# EAGLE design kicker (EAGLE 7.4.0)
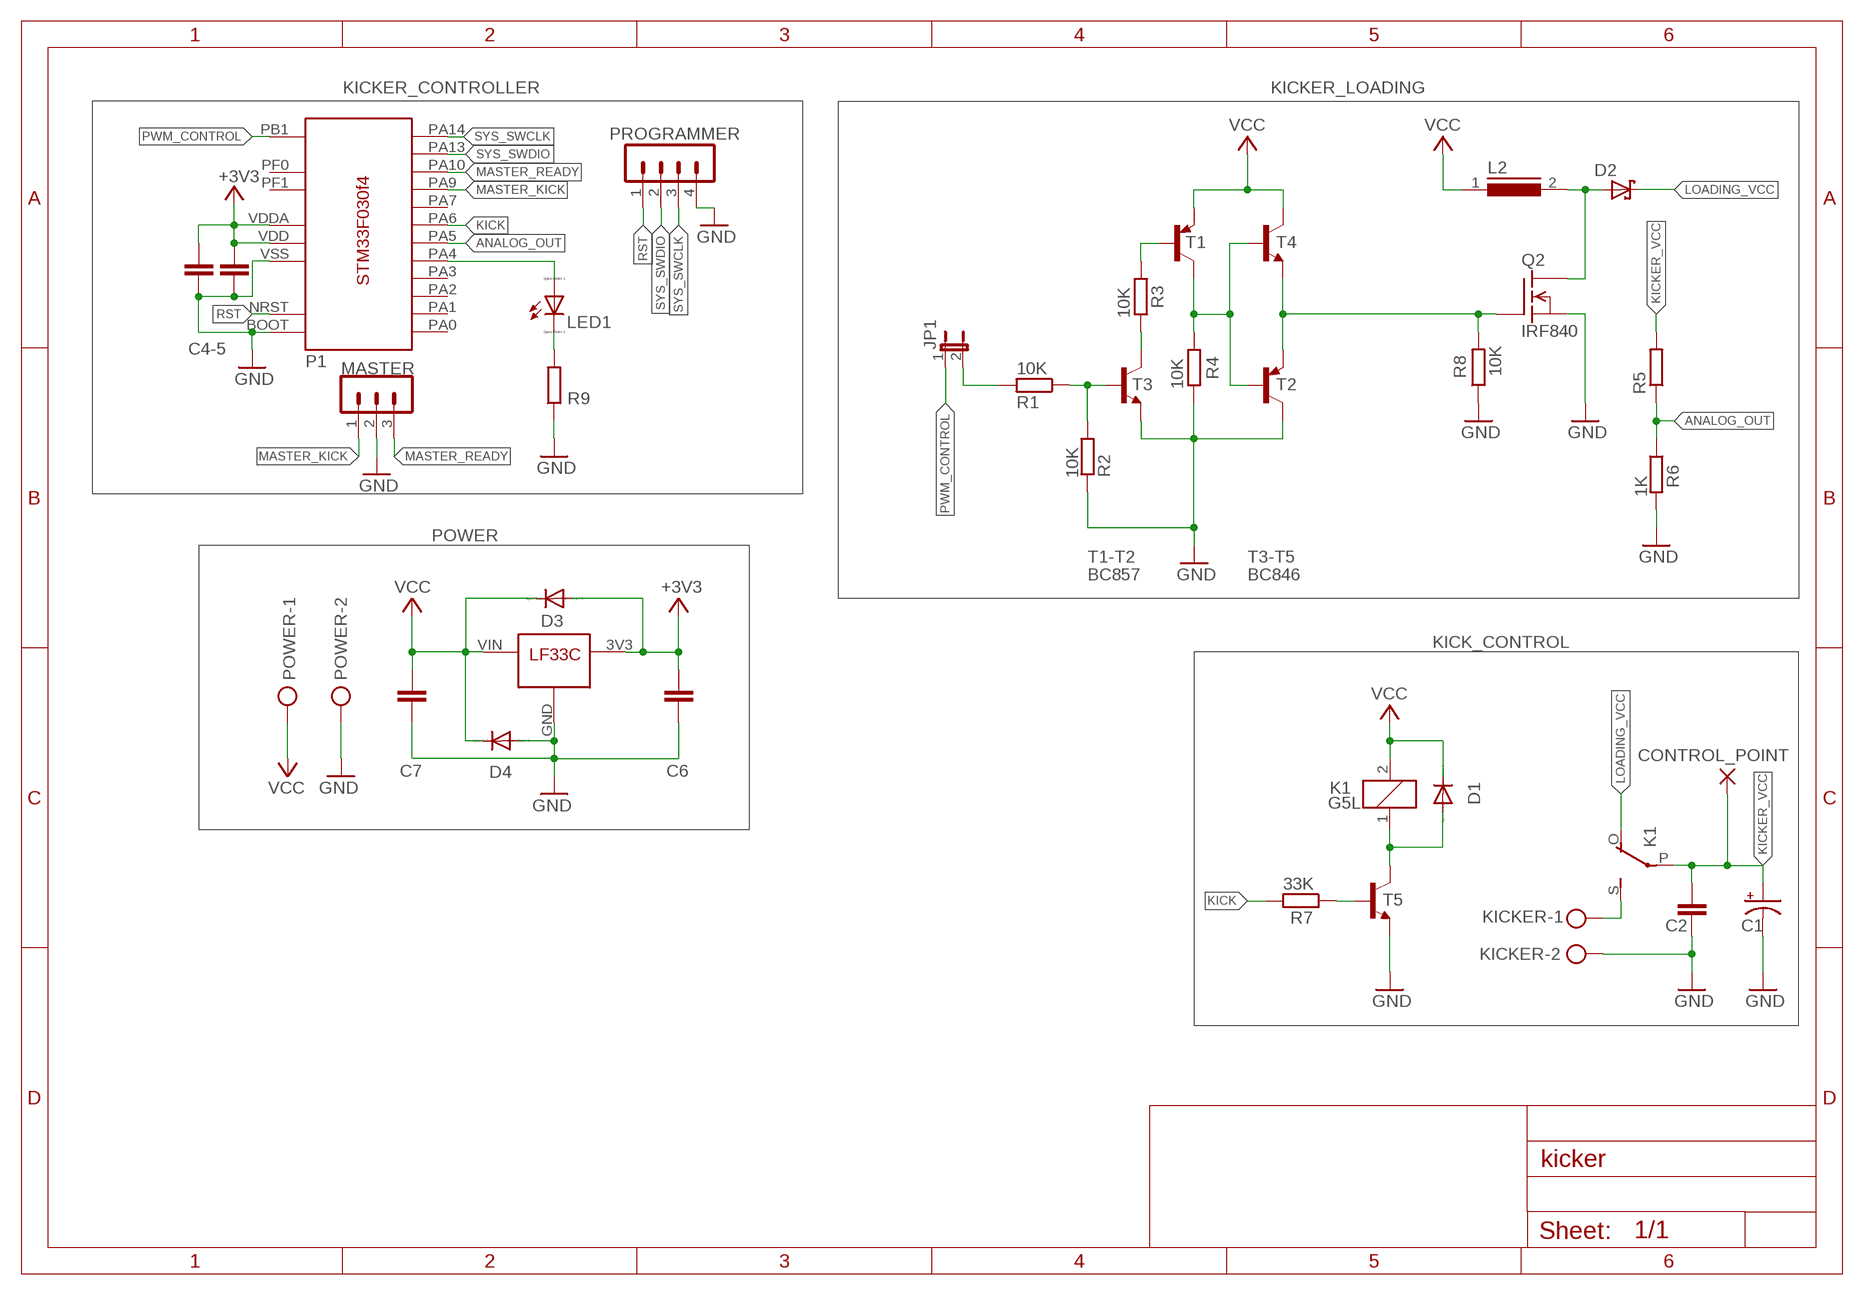
[diagram p0: schematic, sheet 1]

## Parts
C1  CPOL-USE10-30  [EB30D]
C2  C-EU275-113X316  [C275-113X316]
C4  100K  C-EUC0603  [C0603]
C5  100K  C-EUC0603  [C0603]
C6  100k  C-EUC0603  [C0603]
C7  100k  C-EUC0603  [C0603]
CONTROL_POINT  3,81/1,4  [3,81/1,4]
D1  DIODE-MINIMELF  [MINIMELF]
D2  1N6267A  [C4111-15]
D3  DIODE-MINIMELF  [MINIMELF]
D4  DIODE-MINIMELF  [MINIMELF]
JP1  JP1E  [JP1]
K1  G5L  [G5LE]
KICKER  W237-102  [W237-102]
L2  SFT830S  [SFT830S]
LED1  LED_E  [LED_1206]
MASTER  MA03-1  [MA03-1]
P1  STM32F030F4  [STM32F030F4]
POWER  W237-102  [W237-102]
PROGRAMMER  MA04-1  [MA04-1]
Q2  IRF840  [TO220]
R1  10K  R-EU_R0603  [R0603]
R2  10K  R-EU_R0603  [R0603]
R3  10K  R-EU_R0603  [R0603]
R4  10K  R-EU_R0603  [R0603]
R5  R-EU_0309/10  [0309/10]
R6  1K  R-EU_R0603  [R0603]
R7  33K  R-EU_R0603  [R0603]
R8  10K  R-EU_R0603  [R0603]
R9  R-EU_R0603  [R0603]
T1  BC856A-PNP-SOT23-BEC  [SOT23-BEC]
T2  BC856A-PNP-SOT23-BEC  [SOT23-BEC]
T3  BC847  [SOT23]
T4  BC847  [SOT23]
T5  BC847  [SOT23]
U$1  LF33C  [LF33C]

## Nets
+3V3: C4.1 C5.1 C6.1 D3.A P1.VDD P1.VDDA U$1.3V3
ANALOG_OUT: P1.PA5 R5.1 R6.1
GND: C1.- C2.2 C4.2 C5.2 C6.2 C7.2 D4.A KICKER.2 MASTER.2 P1.BOOT P1.VSS POWER.2 PROGRAMMER.4 Q2.3(S) R2.2 R4.2 R6.2 R8.1 R9.1 T2.C T3.2(E) T5.2(E) U$1.GND
KICK: P1.PA6 R7.2
KICKER_VCC: C1.+ C2.1 CONTROL_POINT.1(P) K1.P(2:P) R5.2
LOADING_VCC: D2.C K1.O(2:O)
MASTER_KICK: MASTER.1 P1.PA9
MASTER_READY: MASTER.3 P1.PA10
N$1: R7.1 T5.1(B)
N$2: JP1.2 R1.2
N$3: K1.S(2:S) KICKER.1
N$4: D1.A K1.1 T5.3(C)
N$5: R1.1 R2.1 T3.1(B)
N$9: LED1.C R9.2
N$10: LED1.A P1.PA4
N$11: R3.1 T1.B
N$13: R3.2 T3.3(C)
N$15: R4.1 T1.C T2.B T4.1(B)
N$16: Q2.1(G) R8.2 T2.E T4.2(E)
N$17: D2.A L2.2 Q2.2(D)
PWM_CONTROL: JP1.1 P1.PB1
RST: P1.NRST PROGRAMMER.1
SYS_SWCLK: P1.PA14 PROGRAMMER.3
SYS_SWDIO: P1.PA13 PROGRAMMER.2
VCC: C7.1 D1.C D3.C D4.C K1.2 L2.1 POWER.1 T1.E T4.3(C) U$1.VIN
Unconnected: P1.PA0 P1.PA1 P1.PA2 P1.PA3 P1.PA7 P1.PF0 P1.PF1

## Notes on the sheet
- KICKER_CONTROLLER | KICKER_LOADING
- C4-5
- POWER
- T1-T2 | T3-T5
- BC857 | BC846
- KICK_CONTROL

## Library data of the parts
C1 = rcl:CPOL-US: POLARIZED CAPACITOR, American symbol
C2 C4-C7 = rcl:C-EU: CAPACITOR, European symbol
CONTROL_POINT = wirepad:3,81/1,4: THROUGH-HOLE PAD
D1 D3 D4 = diode:DIODE-: DIODE
D2 = diode:1N6267A: DIODE transient voltage suppressor
JP1 = jumper:JP1E: JUMPER
K1 = relay:G5L: RELAY 1 x switch, 10 A/120 V AC, 8 A/30 V ADC, Omron; OC_FARNELL: unknown; OC_NEWARK: unknown
KICKER POWER = con-wago-500:W237-102: WAGO SCREW CLAMP; MPN: 237-102; OC_FARNELL: unknown; OC_NEWARK: 70K9898
L2 = inductors:SFT830S: INDUCTOR
LED1 = eagle-ltspice:LED_E: LED Source: http://www.osram.convergy.de Source: www.luxeon.com Source: www.kingbright.com; SPICEMODEL: NONE; SPICEPREFIX: D; SPICETYPE: diode
MASTER = con-lstb:MA03-1: PIN HEADER; OC_FARNELL: unknown; OC_NEWARK: unknown
P1 = stm32f030f4:STM32F030F4
PROGRAMMER = con-lstb:MA04-1: PIN HEADER; OC_FARNELL: unknown; OC_NEWARK: unknown
Q2 = transistor-fet:IRF840: N-Channel Enhancement MOSFET (HEXFET); 500V; 8A; 0,85Ohm
R1-R9 = rcl:R-EU_: RESISTOR, European symbol
T1 T2 = transistor-neu-to92:*-PNP-: PNP Transistror
T3-T5 = transistor-neu-to92:BC847: NPN TRANSISTOR
U$1 = regulator:LF33C

## Board
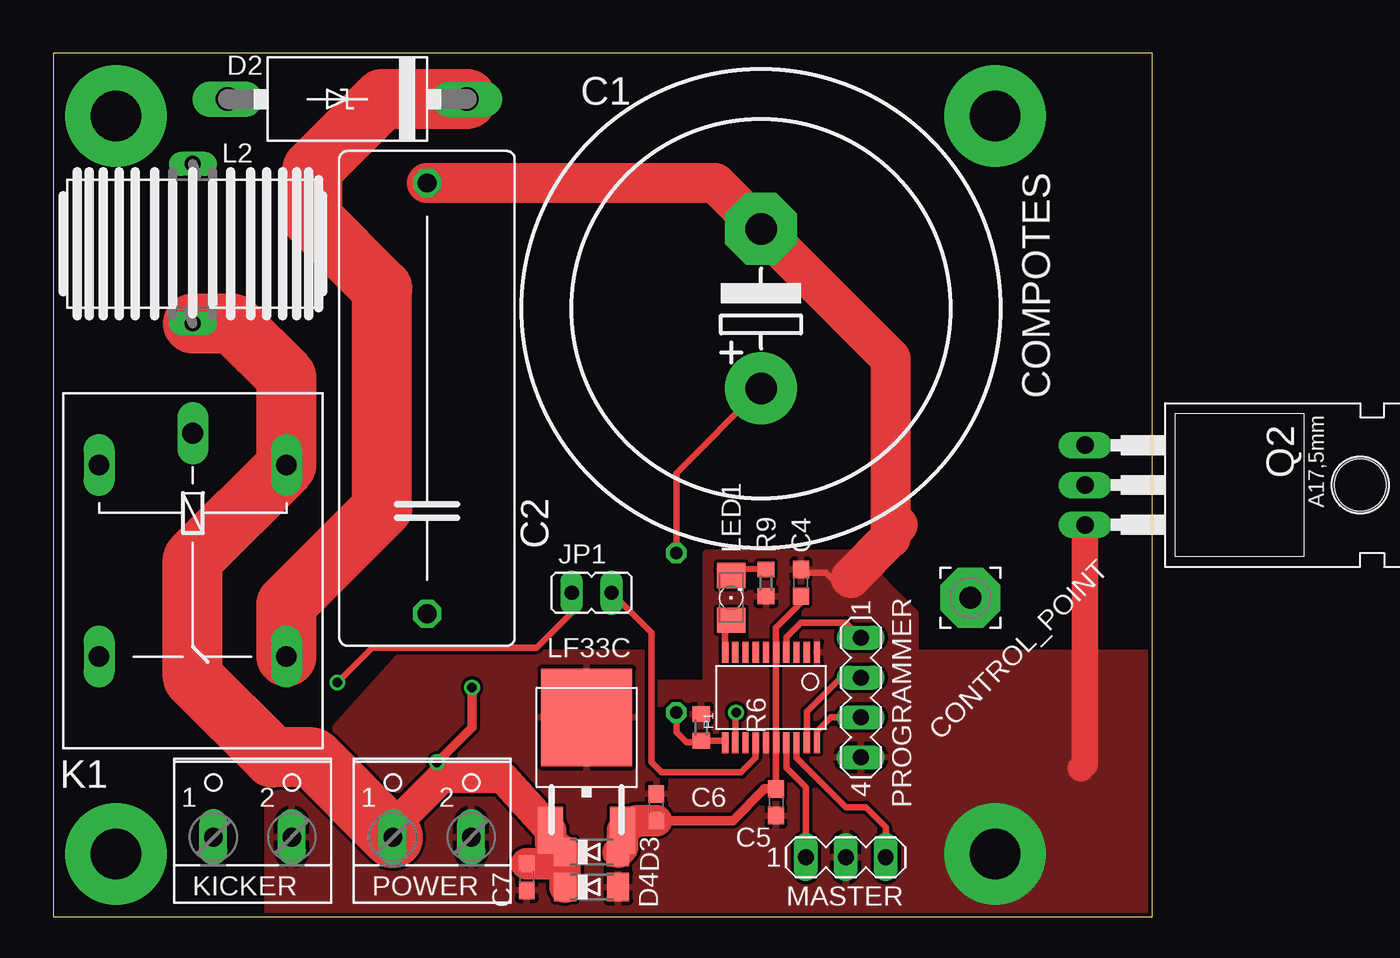
[diagram p1: board, top side]
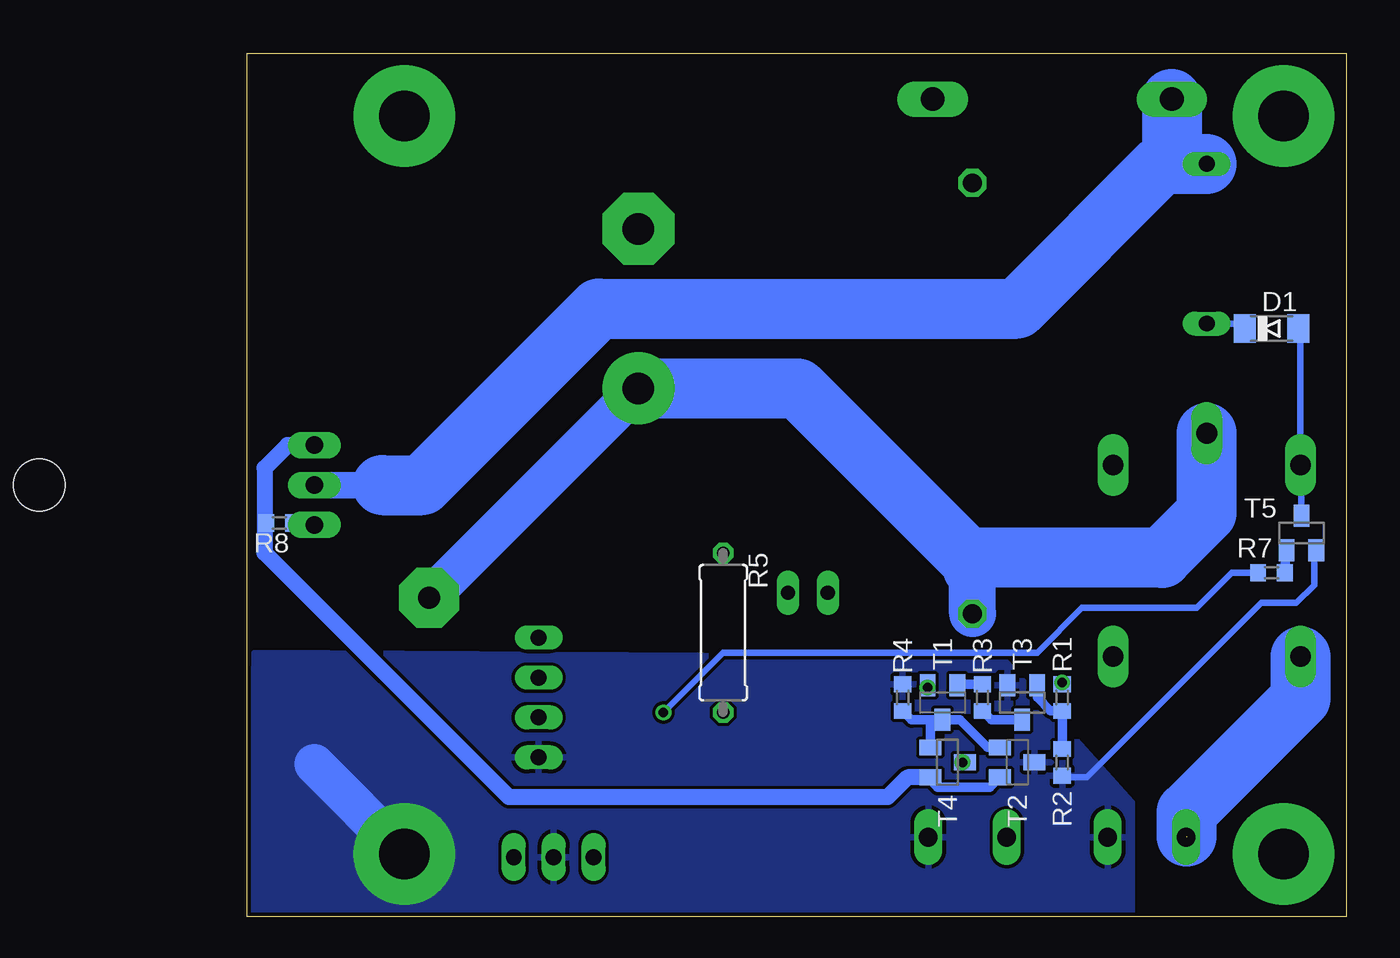
[diagram p2: board, bottom side, seen from below]

Size 70 x 55 mm. Coordinates in mm from the lower left corner, seen from the top.
Outline: 0,0 70,0 70,55 0,55 0,0
Copper layers (1*16): Top 0.035mm / dielectric 1.5mm / Bottom 0.035mm
Design rules "default *": minimum track width 10mil, minimum drill 24mil, track to track 8mil, track to pad 8mil, pad to pad 8mil, via to via 8mil, smd to smd 8mil, copper to edge 10mil, drill to drill 8mil, minimum pad ring 10mil, minimum via ring 8mil, stop-mask expansion 4mil, vias tented up to drill 0mil, thermal gap 10mil

### Footprints (pad centres in the part's own frame; a part is rotated, then mirrored left to right if it is on the bottom)
EB30D = drill 2.007 pad 4.597: + -5.08,0 | drill 2.007 pad 4.597 octagon: - 5.08,0
C275-113X316 = drill 1.194 octagon: 1 -13.716,0; 2 13.716,0
C0603 = smd 1.1 x 1: 1 -0.85,0; 2 0.85,0
3,81/1,4 = drill 1.397 pad 3.81 octagon: 1 0,0
MINIMELF = smd 1.4 x 1.8: A 1.7,0; C -1.7,0
C4111-15 = drill 1.499 long: A 7.62,0; C -7.62,0
JP1 = drill 0.914 long: 1 0,-1.27; 2 0,1.27
G5LE = drill 1.321 long: 1 -7.493,-5.969; 2 -7.493,5.969; O 4.699,5.969; P -9.525,0; S 4.699,-5.969
W237-102 = drill 1.194 long: 1 -2.5,-1.27; 2 2.5,-1.27
SFT830S = drill 1.016 long: 1 -5.08,0; 2 5.08,0
LED_1206 = smd 1.6 x 1.803: A -1.422,0; C 1.422,0
MA03-1 = drill 1.016 long: 1 -2.54,0; 2 0,0; 3 2.54,0
STM32F030F4 = smd 1.35 x 0.4: BOOT -2.875,2.925; NRST -2.875,0.975; PA0 -2.875,-0.325; PA1 -2.875,-0.975; PA2 -2.875,-1.625; PA3 -2.875,-2.275; PA4 -2.875,-2.925; PA5 2.875,-2.925; PA6 2.875,-2.275; PA7 2.875,-1.625; PA9 2.875,0.975; PA10 2.875,1.625; PA13 2.875,2.275; PA14 2.875,2.925; PB1 2.875,-0.975; PF0 -2.875,2.275; PF1 -2.875,1.625; VDD 2.875,0.325; VDDA -2.875,0.325; VSS 2.875,-0.325
MA04-1 = drill 1.016 long: 1 -3.81,0; 2 -1.27,0; 3 1.27,0; 4 3.81,0
TO220 = drill 1.118 long: 1 -2.54,-6.35; 2 0,-6.35; 3 2.54,-6.35 | hole 3.302: 0,11.176
R0603 = smd 1 x 1.1: 1 -0.85,0; 2 0.85,0
0309/10 = drill 0.813 octagon: 1 -5.08,0; 2 5.08,0
SOT23-BEC = smd 1 x 1.4: B -0.95,-1.1; C 0,1.1; E 0.95,-1.1
SOT23 = smd 1 x 1.4: 1 -0.95,-1.1; 2 0.95,-1.1; 3 0,1.1
LF33C = smd 1.6 x 3: 3V3 2.285,-7.18; VIN -2.285,-7.18 | smd 5.8 x 6.2: GND 0,0

### Placement (x,y rotation side)
C1  45.09,38.73 90 top
C2  23.81,33.02 90 top
C4  47.62,21.27 90 top
C5  46.04,7.3 270 top
C6  38.42,6.99 90 top
C7  30.16,2.54 270 top
CONTROL_POINT  58.42,20.32 0 top
D1  4.76,37.47 0 bottom
D2  18.73,52.07 180 top
D3  34.29,4.13 0 top
D4  34.29,1.91 0 top
JP1  34.29,20.64 90 top
K1  8.89,21.27 270 top
KICKER  12.7,6.35 0 top
L2  8.89,42.86 90 top
LED1  43.18,20.32 90 top
MASTER  50.48,3.81 0 top
P1  45.72,13.97 270 top
POWER  24.13,6.35 0 top
PROGRAMMER  51.44,13.97 270 top
Q2  72.07,27.5 270 top
R1  18.1,13.97 90 bottom
R2  18.1,9.84 270 bottom
R3  23.18,13.97 270 bottom
R4  28.26,13.97 90 bottom
R5  39.69,18.1 90 bottom
R6  41.27,12.06 90 top
R7  4.76,21.91 180 bottom
R8  67.94,25.08 180 bottom
R9  45.4,21.27 90 top
T1  25.72,13.65 180 bottom
T2  20.95,9.84 270 bottom
T3  20.64,13.65 180 bottom
T4  25.4,9.84 270 bottom
T5  2.86,24.45 0 bottom
U$1  33.97,12.7 0 top

### Tracks (layer width: path | path; a pad name or v marks a point on that pad's centre or on a via)
2  (via drill 3.2 pad 6.45)
  other vias: 60,51
+3V3
  Top 0.406: C5.1 46.05,8.48 P1.VDD 46.04,11.1 46.04,16.84 P1.VDDA 46.05,18.42 47.62,20 C4.1
  Top 0.61: C6.1 43.28,6.13 45.3,8.15 C5.1
  Top 2: D3.A 36.26,4.39 U$1.3V3 37.19,6.13 C6.1
ANALOG_OUT
  Top 0.406: P1.PA5 42.67,11.21 R6.1 41.17,11.11 40.32,11.11 39.69,11.75 R5.1
GND  (via drill 3.2 pad 6.45)
  Top 0.406: 50.8,21.59 49.53,21.59 49.21,21.91 47.73,21.91 C4.2
  Top 1.676: Q2.3 65.72,9.72 65.47,9.46
  Top 2.54: 53.34,25.4 53.34,35.56 C1.- 42.16,46.74 C2.2 | 53.34,25.4 53.34,24.13 50.8,21.59 | 53.78,24.96 53.34,25.4
  Bottom 0.406: T5.2 2.05,23.35 2.05,21.12 3.17,20 5.4,20 16.51,8.89 18,8.89 R2.2 | R8.1 65.84,25.08 Q2.3
  Bottom 2.54: 65.72,9.72 v60,4
  pour Top: 72.39,-2.54 13.65,-2.54 13.65,7.3 22.23,16.83 38.1,16.83 38.1,14.92 41.59,14.92 41.59,23.18 51.12,23.18 54.93,19.37 54.93,16.83 72.39,16.83
  pour Bottom: 69.85,0 13.65,0 13.65,7.3 21.91,16.51 69.53,16.83
KICK  (via drill 0.6)
  Top 0.406: P1.PA6 43.45,13.07 v43.5,13.02
  Bottom 0.406: v43.5,13.02 39.69,16.83 19.68,16.83 16.83,19.68 9.53,19.68 7.3,21.91 R7.2
KICKER_VCC
  Top 0.406: C1.+ 39.69,28.26 R5.2
  Bottom 2.54: C1.+ CONTROL_POINT.1
  Bottom 3: C2.1 23.81,22.23
  Bottom 3.81: K1.P 8.89,25.72 11.75,22.86 23.81,22.86 | 23.81,22.86 24.13,22.86 34.92,33.66 C1.+ | 23.81,22.23 23.81,22.86
LOADING_VCC
  Top 3.81: K1.O 14.86,19.94 20.95,26.04 20.95,40.01 16.51,44.45 16.51,47.62 20.95,52.07 D2.C
MASTER_KICK
  Top 0.406: P1.PA9 46.7,9.5 47.94,8.26 MASTER.1
MASTER_READY
  Top 0.406: P1.PA10 47.34,10.12 50.48,6.99 51.75,6.99 53.02,5.71 MASTER.3
N$1
  Bottom 0.61: T5.1 3.88,23.28 3.88,22.07 R7.1
N$2  (via drill 0.6)
  Top 0.406: v18.1,14.92 20.32,17.14 30.8,17.14 33.02,19.37 JP1.2
  Bottom 0.406: R1.2 v18.1,14.92
N$3  (1 unrouted)
  Bottom 3.81: 10.16,5.12 10.16,6.67 2.92,13.91 K1.S
N$4
  Bottom 0.406: T5.3 2.86,28.7 K1.1 2.92,37.32 D1.A
N$5
  Bottom 0.61: 19.62,14.82 T3.1 19.69,13.97 18.84,13.12 R1.1 R2.1
N$6  (via drill 3.2 pad 6.45)
  other vias: 4,51
N$7  (via drill 3.2 pad 6.45)
  other vias: 4,4
N$9
  Top 0.406: R9.2 42.44,22.16 LED1.C
N$10
  Top 0.406: P1.PA4 42.8,18.51 LED1.A
N$11
  Bottom 0.61: R3.1 24.7,14.82 T1.B
N$13
  Bottom 0.61: T3.3 22.61,12.55 R3.2
N$15
  Bottom 0.61: 26.67,12.55 T1.C 24.62,12.55 22.86,10.79 T2.B | 26.67,12.55 27.69,12.55 R4.1 | T4.1 26.5,12.4 26.67,12.55
N$16
  Bottom 0.406: R8.2 68.8,24.23 68.9,24.13
  Bottom 0.61: T4.2 26.67,8.89 26.04,8.26 22.69,8.26 T2.E
  Bottom 1.016: 26.67,8.89 27.94,8.89 29.21,7.62 53.34,7.62 68.9,23.18 68.9,24.13 68.9,28.57 67.43,30.04 Q2.1
N$17
  Bottom 1.676: Q2.2 61.4,27.5
  Bottom 3.81: 61.4,27.5 58.86,27.5 47.62,38.73 20.95,38.73 11.75,47.94 11.43,47.94 | 11.43,47.94 L2.2 | D2.A 11.11,48.26 11.43,47.94
PWM_CONTROL
  Top 0.406: P1.PB1 44.74,10.14 43.81,9.21 38.73,9.21 38.1,9.84 38.1,18.1 JP1.1
RST
  Top 0.406: P1.NRST 46.7,17.8 47.62,18.73 50.48,18.73 PROGRAMMER.1
SYS_SWCLK
  Top 0.406: P1.PA14 48.65,11.81 49.53,12.7 PROGRAMMER.3
SYS_SWDIO
  Top 0.406: P1.PA13 47.99,13.07 50.16,15.24 PROGRAMMER.2
VCC  (via drill 0.6)
  Top 0.61: v26.67,14.61 26.67,12.06 v24.45,9.84 25.4,8.89
  Top 2: D3.C 31.69,4.71 U$1.VIN 28.64,8.89 25.4,8.89 24.77,8.89 21.63,5.75 POWER.1 | D3.C D4.C | C7.1 31.85,3.39 D3.C
  Top 3.81: POWER.1 21.63,5.04 16.51,10.16 13.97,10.16 8.89,15.24 8.89,22.8 K1.2 14.86,34.35 11.43,37.78 L2.1
  Bottom 0.406: L2.1 6.78,37.78 D1.C
  Bottom 0.61: T1.E v26.67,14.61 | v24.45,9.84 T4.3

### Text on the board
tNames: COMPOTES